# EAGLE design Main (EAGLE 7.6.0)
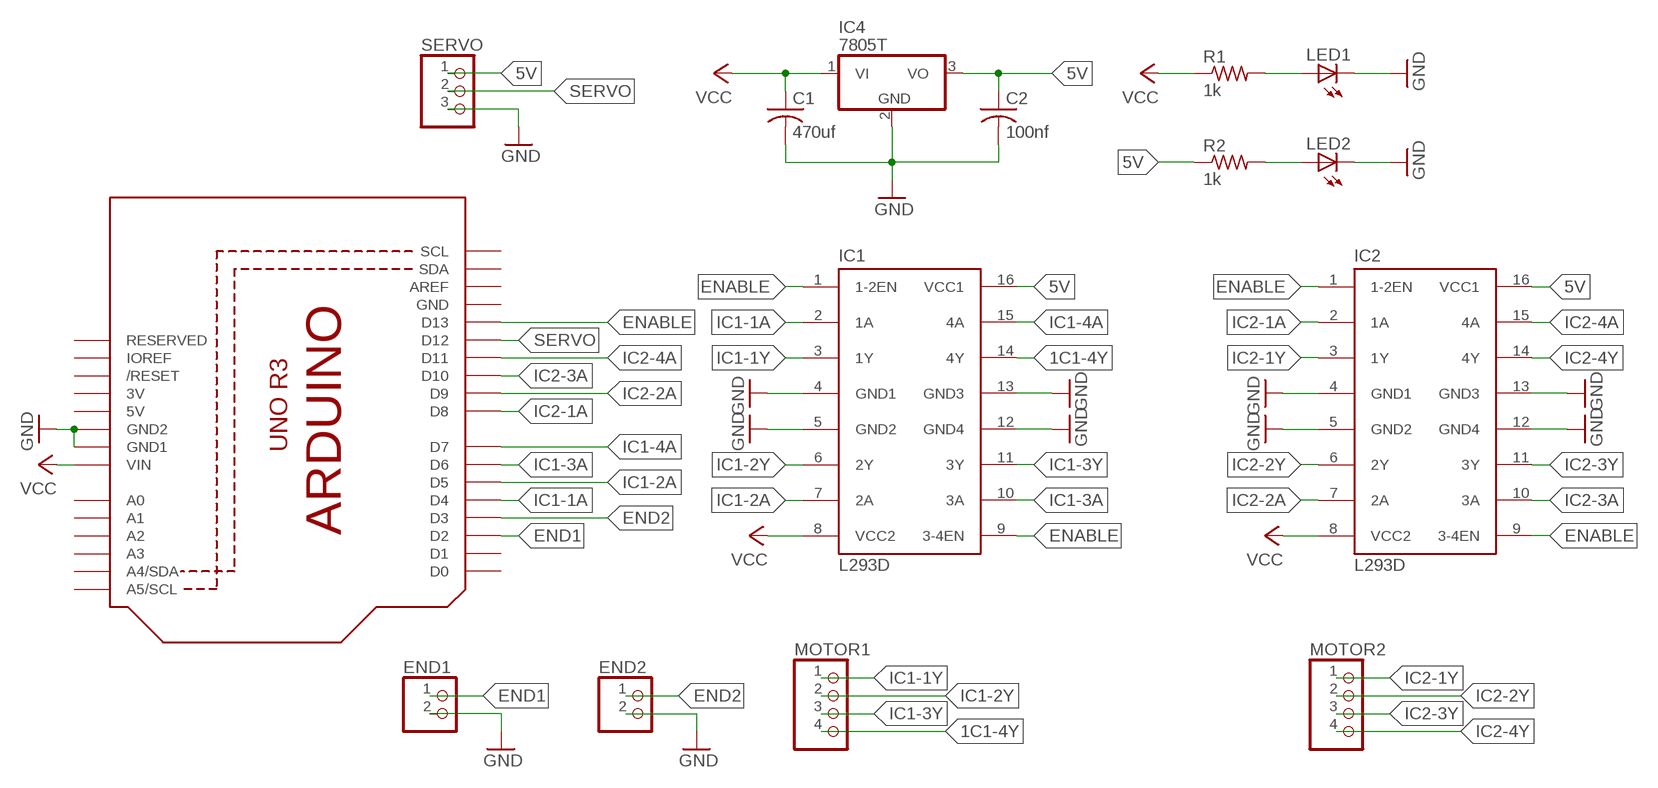
[diagram p0: schematic, sheet 1]

## Parts
C1  470uf  C-US025-025X050  [C025-025X050]
C2  100nf  C-US025-025X050  [C025-025X050]
END1  PINHD-1X2  [1X02]
END2  PINHD-1X2  [1X02]
IC1  L293D  [DIL16]
IC2  L293D  [DIL16]
IC4  7805T  [TO220H]
LED1  LED3MM  [LED3MM]
LED2  LED3MM  [LED3MM]
MOTOR1  PINHD-1X4  [1X04]
MOTOR2  PINHD-1X4  [1X04]
R1  1k  R-US_0204/7  [0204/7]
R2  1k  R-US_0204/7  [0204/7]
SERVO  PINHD-1X3  [1X03]
U1  ARDUINOR3-BPLACE  [ARDUINOR3-BPLACE]

## Nets
1C1-4Y: IC1.14(4Y) MOTOR1.4
5V: C2.1 IC1.16(VCC1) IC2.16(VCC1) IC4.3(VO) R2.1 SERVO.1
ENABLE: IC1.1(1-2EN) IC1.9(3-4EN) IC2.1(1-2EN) IC2.9(3-4EN) U1.D13
END1: END1.1 U1.D2
END2: END2.1 U1.D3
GND: C1.2 C2.2 END1.2 END2.2 IC1.4(GND1) IC1.5(GND2) IC1.12(GND4) IC1.13(GND3) IC2.4(GND1) IC2.5(GND2) IC2.12(GND4) IC2.13(GND3) IC4.2(GND) LED1.K(C) LED2.K(C) SERVO.3 U1.GND1 U1.GND2
IC1-1A: IC1.2(1A) U1.D4
IC1-1Y: IC1.3(1Y) MOTOR1.1
IC1-2A: IC1.7(2A) U1.D5
IC1-2Y: IC1.6(2Y) MOTOR1.2
IC1-3A: IC1.10(3A) U1.D6
IC1-3Y: IC1.11(3Y) MOTOR1.3
IC1-4A: IC1.15(4A) U1.D7
IC2-1A: IC2.2(1A) U1.D8
IC2-1Y: IC2.3(1Y) MOTOR2.1
IC2-2A: IC2.7(2A) U1.D9
IC2-2Y: IC2.6(2Y) MOTOR2.2
IC2-3A: IC2.10(3A) U1.D10
IC2-3Y: IC2.11(3Y) MOTOR2.3
IC2-4A: IC2.15(4A) U1.D11
IC2-4Y: IC2.14(4Y) MOTOR2.4
N$1: LED1.A R1.2
N$2: LED2.A R2.2
SERVO: SERVO.2 U1.D12
VCC: C1.1 IC1.8(VCC2) IC2.8(VCC2) IC4.1(VI) R1.1 U1.VIN
Unconnected: U1.A0 U1.A1 U1.A2 U1.A3 U1.A4(A4/SDA) U1.A5(A5/SCL) U1.AREF U1.D0 U1.D1 U1.IOREF U1.RESERVED U1.RESET(/RESET) U1.SCL U1.SDA

## Power pins joined to a net without a drawn wire
3V: U1.3V
5V: U1.5V
GND: U1.GND

## Library data of the parts
C1 C2 = adafruit:C-US: CAPACITOR, American symbol
END1 END2 = pinhead:PINHD-1X2: PIN HEADER
IC1 IC2 = st-microelectronics:L293D: PUSH-PULL 4 CHANNEL DRIVER; MPN: L293D; OC_FARNELL: 9589619; OC_NEWARK: 56P8249
IC4 = adafruit:78*: Positive VOLTAGE REGULATOR Added bigger pads to the TO-92 package
LED1 LED2 = adafruit:LED: LED OSRAM: - CHIPLED LG R971, LG N971, LY N971, LG Q971, LY Q971, LO R971, LY R971 LH N974, LH R974 LS Q976, LO Q976, LY Q976 LO Q996 - Hyper CHIPLED LW Q18S LB Q993, LB Q99A, LB R99A - SideLED LS A670, LO A670, LY A670, LG A670, LP A670 LB A673, LV A673, LT A673, LW A673 LH A674 LY A675 LS A676, LA A676, LO A676, LY A676, LW A676 LS A679, LY A679, LG A679 - Hyper Micro SIDELED® LS Y876, LA Y876, LO Y876, LY Y876 LT Y87S - SmartLED LW L88C, LW L88S LB L89C, LB L89S, LG L890 LS L89K, LO L89K, LY L89K LS L896, LA L896, LO L896, LY L896 - TOPLED LS T670, LO T670, LY T670, LG T670, LP T670 LSG T670, LSP T670, LSY T670, LOP T670, LYG T670 LG T671, LOG T671, LSG T671 LB T673, LV T673, LT T673, LW T673 LH T674 LS T676, LA T676, LO T676, LY T676, LB T676, LH T676, LSB T676, LW T676 LB T67C, LV T67C, LT T67C, LS T67K, LO T67K, LY T67K, LW E67C LS E67B, LA E67B, LO E67B, LY E67B, LB E67C, LV E67C, LT E67C LW T67C LS T679, LY T679, LG T679 LS T770, LO T770, LY T770, LG T770, LP T770 LB T773, LV T773, LT T773, LW T773 LH T774 LS E675, LA E675, LY E675, LS T675 LS T776, LA T776, LO T776, LY T776, LB T776 LHGB T686 LT T68C, LB T68C - Hyper Mini TOPLED® LB M676 - Mini TOPLED Santana® LG M470 LS M47K, LO M47K, LY M47K Source: http://www.osram.convergy.de/
MOTOR1 MOTOR2 = pinhead:PINHD-1X4: PIN HEADER
R1 R2 = adafruit:R-US_: RESISTOR, American symbol
SERVO = pinhead:PINHD-1X3: PIN HEADER
U1 = adafruit:ARDUINOR3: This is a new object for the new Arduino R3 - with extra pins that you may want to use (such as IOref, and duplicated A4/A5

## Board
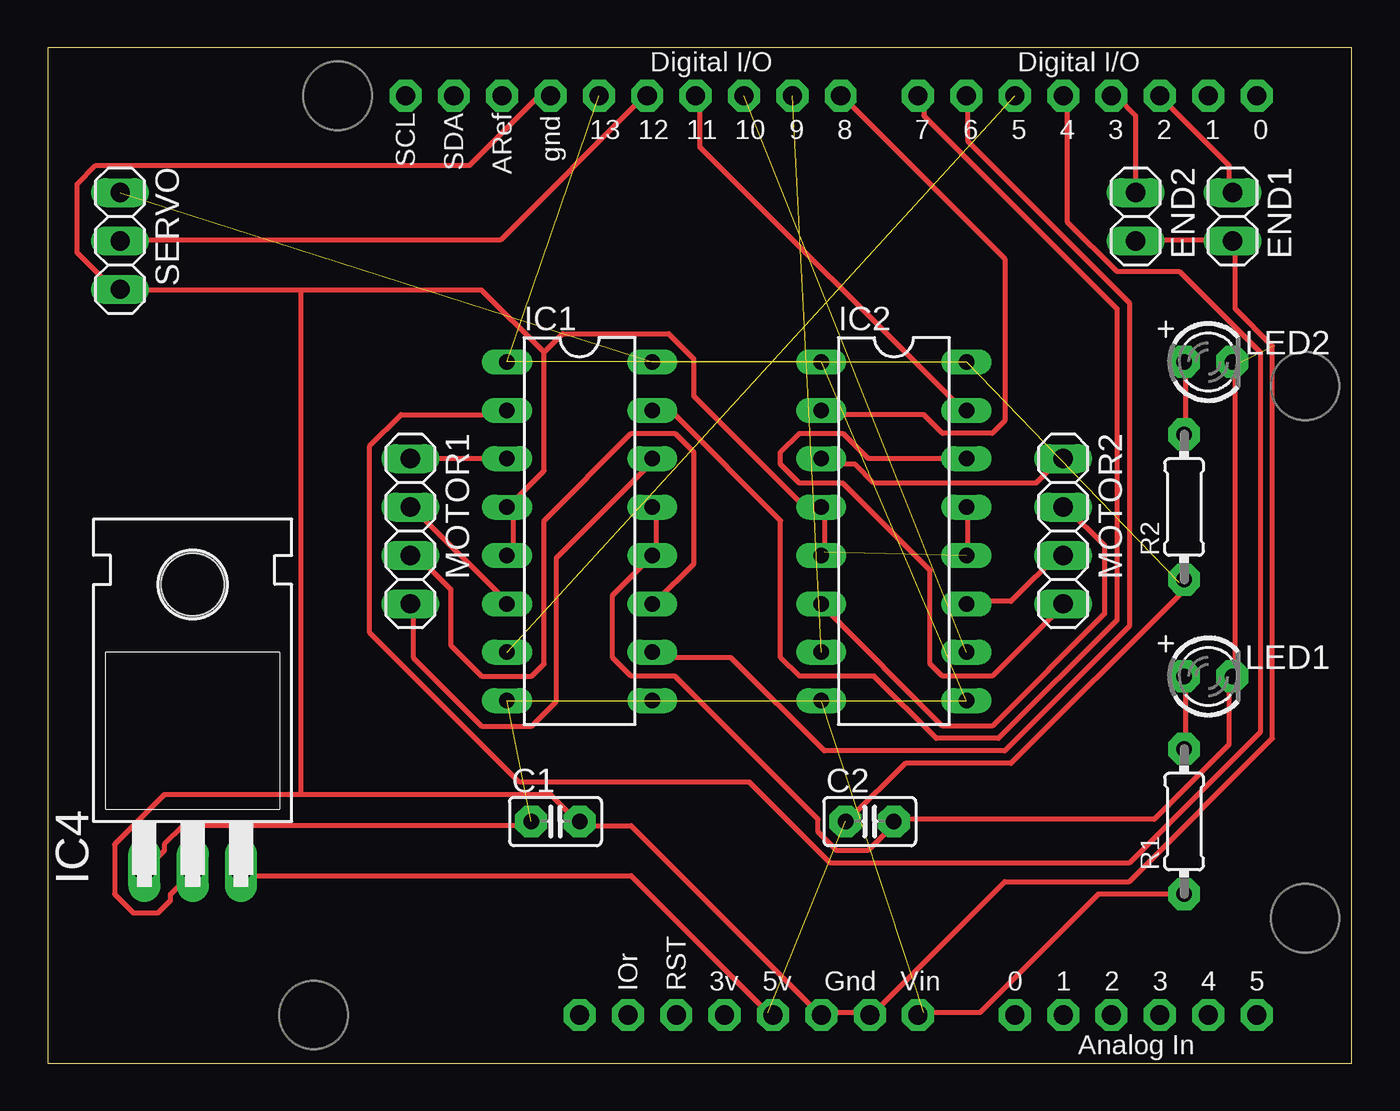
[diagram p1: board, top side]
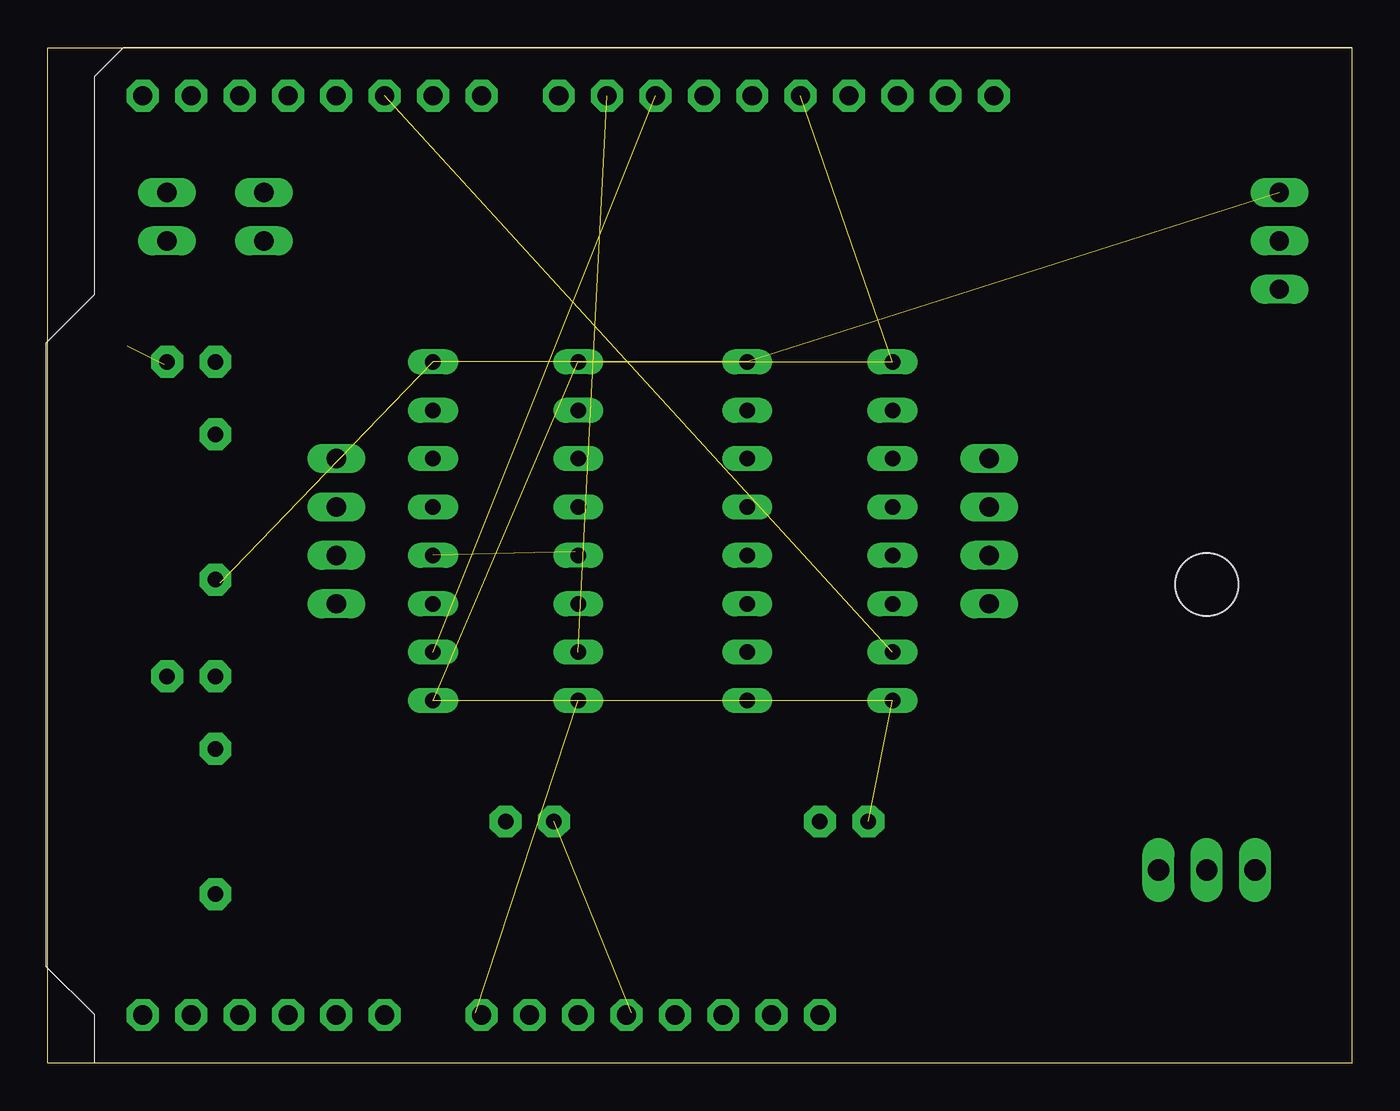
[diagram p2: board, bottom side, seen from below]

Size 68.5 x 53.33 mm. Coordinates in mm from the lower left corner, seen from the top.
Outline: 0,0 68.5,0 68.5,53.33 0,53.33 0,0
Copper layers (1*16): Top 0.035mm / dielectric 1.5mm / Bottom 0.035mm
Design rules "default *": minimum track width 10mil, minimum drill 24mil, track to track 0.4mm, track to pad 0.4mm, pad to pad 0.4mm, via to via 0.4mm, smd to smd 0.4mm, copper to edge 40mil, drill to drill 8mil, minimum pad ring 10mil, minimum via ring 8mil, stop-mask expansion 4mil, vias tented up to drill 0mil, thermal gap 10mil

### Footprints (pad centres in the part's own frame; a part is rotated, then mirrored left to right if it is on the bottom)
C025-025X050 = drill 0.813 pad 1.676 octagon: 1 -1.27,0; 2 1.27,0
1X02 = drill 1.016 long: 1 -1.27,0; 2 1.27,0
DIL16 = drill 0.813 long: 1 -8.89,-3.81; 2 -6.35,-3.81; 3 -3.81,-3.81; 4 -1.27,-3.81; 5 1.27,-3.81; 6 3.81,-3.81; 7 6.35,-3.81; 8 8.89,-3.81; 9 8.89,3.81; 10 6.35,3.81; 11 3.81,3.81; 12 1.27,3.81; 13 -1.27,3.81; 14 -3.81,3.81; 15 -6.35,3.81; 16 -8.89,3.81
TO220H = drill 1.118 long: 1 -2.54,-10.16; 2 0,-10.16; 3 2.54,-10.16 | hole 3.302: 0,4.826
LED3MM = drill 0.813 pad 1.676 octagon: A -1.27,0; K 1.27,0
1X04 = drill 1.016 long: 1 -3.81,0; 2 -1.27,0; 3 1.27,0; 4 3.81,0
0204/7 = drill 0.813 pad 1.676 octagon: 1 -3.81,0; 2 3.81,0
1X03 = drill 1.016 long: 1 -2.54,0; 2 0,0; 3 2.54,0
ARDUINOR3-BPLACE = drill 1 pad 1.676 octagon: 3V 35.56,2.54; 5V 38.1,2.54; A0 50.8,2.54; A1 53.34,2.54; A2 55.88,2.54; A3 58.42,2.54; A4 60.96,2.54; A5 63.5,2.54; AREF 23.876,50.8; D0 63.5,50.8; D1 60.96,50.8; D2 58.42,50.8; D3 55.88,50.8; D4 53.34,50.8; D5 50.8,50.8; D6 48.26,50.8; D7 45.72,50.8; D8 41.656,50.8; D9 39.116,50.8; D10 36.576,50.8; D11 34.036,50.8; D12 31.496,50.8; D13 28.956,50.8; GND 26.416,50.8; GND1 43.18,2.54; GND2 40.64,2.54; IOREF 30.48,2.54; RESERVED 27.94,2.54; RESET 33.02,2.54; SCL 18.796,50.8; SDA 21.336,50.8; VIN 45.72,2.54

### Placement (x,y rotation side)
C1  26.67,12.7 0 top
C2  43.18,12.7 0 top
END1  62.23,44.45 270 top
END2  57.15,44.45 270 top
IC1  27.94,27.94 270 top
IC2  44.45,27.94 270 top
IC4  7.62,20.32 0 top
LED1  60.96,20.32 0 top
LED2  60.96,36.83 0 top
MOTOR1  19.05,27.94 270 top
MOTOR2  53.34,27.94 270 top
R1  59.69,12.7 90 top
R2  59.69,29.21 90 top
SERVO  3.81,43.18 270 top
U1  0,0 0 top

### Tracks (layer width: path | path; a pad name or v marks a point on that pad's centre or on a via)
1C1-4Y
  Top 0.254: IC1.14 31.64,31.45 26.73,26.54 26.73,19.02 25.42,17.71 22.81,17.71 19.21,21.31 19.21,23.92 MOTOR1.4
5V  (4 unrouted)
  Top 0.254: C2.1 42.1,12.81 45.04,15.75 50.6,15.75 59.43,24.58 59.43,25.23 R2.1 | U1.5V 37.85,2.67 30.65,9.86 10.38,9.86 IC4.3
ENABLE  (4 unrouted)
END1
  Top 0.254: END1.1 62.05,45.83 62.05,47.14 58.45,50.74 U1.D2
END2
  Top 0.254: END2.1 57.14,45.83 57.14,49.76 56.16,50.74 U1.D3
GND  (2 unrouted)
  Top 0.254: IC2.5 40.79,26.87 40.79,29.16 IC2.4 40.46,29.48 39.48,29.48 33.92,35.04 33.92,37 32.62,38.31 27.06,38.31 26.08,37.33 | IC1.5 24.44,26.87 24.44,29.16 IC1.4 24.44,29.48 26.08,31.12 26.08,37.33 | 13.32,40.6 22.81,40.6 26.08,37.33 | 13.32,40.6 3.84,40.6 SERVO.3 3.51,40.6 1.55,42.56 1.55,46.16 2.53,47.14 22.15,47.14 25.75,50.74 26.4,50.74 U1.GND | END2.2 57.47,43.22 62.05,43.22 END1.2 62.37,42.89 62.37,39.62 64.34,37.66 64.34,17.06 56.81,9.54 50.27,9.54 43.41,2.67 U1.GND1 43.08,2.67 40.79,2.67 U1.GND2 40.46,2.67 30.65,12.48 28.04,12.48 C1.2 27.71,12.81 26.4,14.11 13.32,14.11 | 13.32,14.11 6.13,14.11 3.51,11.5 3.51,8.88 4.49,7.9 5.8,7.9 6.46,8.55 6.46,8.88 7.44,9.86 IC4.2 | 13.32,14.11 13.32,40.6 | IC2.12 48.31,26.87 48.31,29.16 IC2.13 | IC1.13 31.96,29.16 31.96,26.87 IC1.12 31.64,26.54 29.67,24.58 29.67,21.31 30.65,20.33 32.94,20.33 40.46,12.81 40.46,12.15 41.44,11.17 43.08,11.17 44.39,12.48 C2.2 44.72,12.81 58.12,12.81 62.05,16.73 62.05,20 LED1.K 62.37,20.33 62.37,36.68 LED2.K
IC1-1A
  Top 0.254: IC1.2 24.11,34.06 18.55,34.06 16.92,32.43 16.92,22.62 24.77,14.77 36.87,14.77 41.12,10.52 56.81,10.52 63.68,17.38 63.68,37.33 59.43,41.58 56.16,41.58 53.54,44.2 53.54,50.74 U1.D4
IC1-1Y
  Top 0.254: IC1.3 24.11,31.77 19.21,31.77 MOTOR1.1
IC1-2A  (1 unrouted)
IC1-2Y
  Top 0.254: IC1.6 24.11,24.25 19.21,29.16 MOTOR1.2
IC1-3A
  Top 0.254: IC1.10 31.96,21.31 35.89,21.31 40.79,16.4 50.27,16.4 56.81,22.94 56.81,39.95 48.31,48.45 48.31,50.74 U1.D6
IC1-3Y
  Top 0.254: IC1.11 31.96,24.25 33.92,26.21 33.92,32.1 32.94,33.08 30.65,33.08 26.08,28.5 26.08,20.98 25.42,20.33 22.81,20.33 21.17,21.96 21.17,24.9 19.21,26.87 MOTOR1.3
IC1-4A
  Top 0.254: IC1.15 31.96,34.06 32.94,34.06 38.5,28.5 38.5,21.31 39.48,20.33 43.41,20.33 46.68,17.06 49.95,17.06 56.16,23.27 56.16,39.62 46.02,49.76 46.02,50.74 U1.D7
IC2-1A
  Top 0.254: IC2.2 40.79,34.06 46.02,34.06 47,33.08 49.62,33.08 50.27,33.73 50.27,42.24 41.77,50.74 U1.D8
IC2-1Y
  Top 0.254: IC2.3 40.79,31.45 42.43,31.45 43.41,30.46 51.91,30.46 53.22,31.77 MOTOR2.1
IC2-2A  (1 unrouted)
IC2-2Y
  Top 0.254: IC2.6 40.79,23.92 47,17.71 49.62,17.71 55.51,23.6 55.51,27.19 53.54,29.16 MOTOR2.2
IC2-3A  (1 unrouted)
IC2-3Y
  Top 0.254: IC2.11 48.31,24.25 50.6,24.25 53.22,26.87 MOTOR2.3
IC2-4A
  Top 0.254: IC2.15 47.98,34.39 34.25,48.12 34.25,50.74 U1.D11
IC2-4Y
  Top 0.254: IC2.14 47.98,31.77 43.08,31.77 41.77,33.08 39.48,33.08 38.5,32.1 38.5,31.45 39.48,30.46 41.77,30.46 46.35,25.89 46.35,20.98 47,20.33 49.62,20.33 53.22,23.92 MOTOR2.4
N$1
  Top 0.254: R1.2 59.76,16.73 59.76,20 LED1.A
N$2
  Top 0.254: R2.2 59.76,33.08 59.76,36.68 LED2.A
SERVO
  Top 0.254: SERVO.2 3.84,43.22 23.79,43.22 31.31,50.74 U1.D12
VCC  (3 unrouted)
  Top 0.254: IC4.1 5.15,10.19 6.13,11.17 6.13,11.5 7.11,12.48 25.1,12.48 C1.1 | U1.VIN 46.02,2.67 48.97,2.67 55.18,8.88 59.43,8.88 R1.1